# Altium schematic sheet 5R_Supply.SchDoc: 5R Supply
size OrCAD A; DocumentNumber: LM-008; Revision: B; SheetNumber: 3; SheetTotal: 7
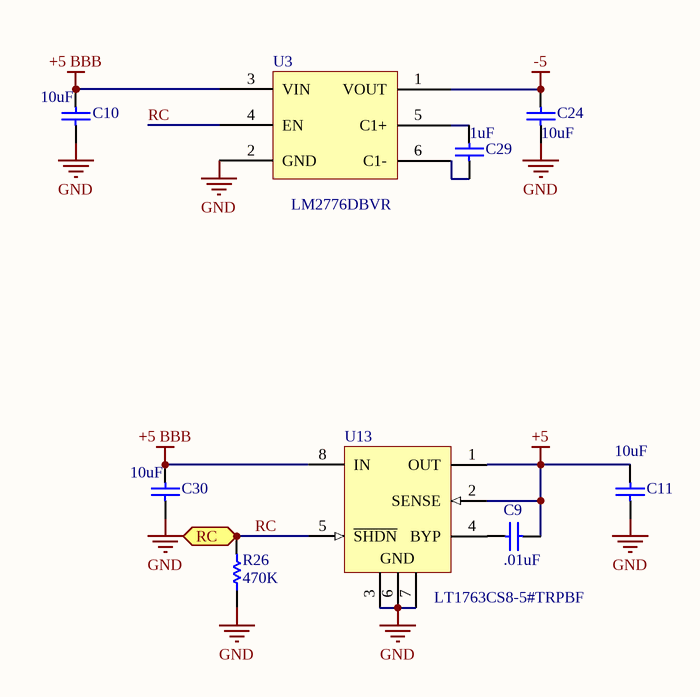
[diagram p0: 5R_Supply.SchDoc]

## Parts
C9  .01uF  [CAPC0805(2012)145_N]
C10  10uF  [CAPC0805(2012)145_N]
C11  10uF  [CAPC0805(2012)145_N]
C24  10uF  [CAPC0805(2012)145_N]
C29  1uF  [CAPC0805(2012)145_N]
C30  10uF  [CAPC0805(2012)145_N]
R26  470K  [RESC0805(2012)_M]
U3  LM2776DBVR  [LM2776DBVR]
U13  LT1763CS8-5#TRPBF  [LT-S8-8_M]

## Ports
RC

## Nets
+5: C9.2 C11.1 U13.1(OUT) U13.2(SENSE)
+5 BBB: C10.1 C30.1 U3.3(VIN) U13.8(IN)
-5: C24.1 U3.1(VOUT)
GND: C10.2 C11.2 C24.2 C30.2 R26.1 U3.2(GND) U13.3(GND) U13.6(GND) U13.7(GND)
RC: R26.2 U3.4(EN) U13.5(~{SHDN}) ; port RC
NetC9_1: C9.1 U13.4(BYP)
NetC29_1: C29.1 U3.5(C1+)
NetC29_2: C29.2 U3.6(C1-)

## Notes on the sheet
- Title
- Size:
- Date:
- Orcad A
- Number:
- Time:
- Revision:
- Sheet
- of
- ZLS Corporation
- 7801 North Lamar Blvd.
- Suite E-184
- Austin, Texas 78752  USA
- (512) 453-0288
- File:

## Library data of the parts
C9 = CMP-1036-04795-1: Manufacturer: Yageo; Manufacturer Part Number: AC0805KRX7R7BB103; Description: CAP CER 10000PF 16V X7R 0805; Tolerance: ±10%; Voltage - Rated: 16V; Temperature Coefficient: X7R; Supplier 1: Digi-Key; Supplier Part Number 1: 311-3161-6-ND; RoHS: RoHS Compliant; Category: Capacitors; Stock 1: 311; Pricing 1: 1=0.22, 10=0.158, 100=0.0745, 500=0.05224, 1000=0.04324 (USD); Packaging: Digi-Reel®; Part Status: Active; Operating Temperature: -55°C ~ 125°C; Features: -; Ratings: AEC-Q200; Applications: Automotive; Failure Rate: -; Mounting Type: Surface Mount, MLCC; Package / Case: 0805 (2012 Metric); Size / Dimension: 0.079" L x 0.049" W (2.00mm x 1.25mm); Height - Seated (Max): -; Thickness (Max): 0.037" (0.95mm); Lead Spacing: -; Lead Style: -; ComponentLink1URL: http://www.yageo.com/NewPortal/_en/search/productDocs.jsp?YageoPartNumber=AC0805KRX7R7BB103; ComponentLink1Description: http://www.yageo.com/NewPortal/_en/search/productDocs.jsp?YageoPartNumber=AC0805KRX7R7BB103
C10 C11 C24 C30 = CMP-1036-04795-1: CAP CER 10UF 25V X7R 0805; Manufacturer: Yageo; Manufacturer Part Number: CC0805KKX7R6BB106; Description: CAP CER 10UF 10V X7R 0805; Tolerance: ±10%; Voltage - Rated: 10V; Notification: Current market demand for these product types have resulted in fluctuating and extending lead times. Lead times may differ.; Supplier 1: Digi-Key; Supplier Part Number 1: 311-1879-6-ND; RoHS: RoHS Compliant; Category: Capacitors; Stock 1: 0; Pricing 1: 1=0.45 (USD); Packaging: Digi-Reel®; Part Status: Discontinued at Digi-Key; Temperature Coefficient: X7R; Operating Temperature: -55°C ~ 125°C; Features: -; Ratings: -; Applications: General Purpose; Failure Rate: -; Mounting Type: Surface Mount, MLCC; Package / Case: 0805 (2012 Metric); Size / Dimension: 0.079" L x 0.049" W (2.00mm x 1.25mm); Height - Seated (Max): -; Thickness (Max): 0.057" (1.45mm); Lead Spacing: -; Lead Style: -; ComponentLink1URL: http://www.yageo.com/documents/recent/UPY-GPHC_X7R_6.3V-to-50V_18.pdf; ComponentLink1Description: http://www.yageo.com/documents/recent/UPY-GPHC_X7R_6.3V-to-50V_18.pdf
C29 = CMP-1036-04795-1: CAP CER 1UF 25V X7R 0805; Manufacturer: Yageo; Manufacturer Part Number: CC0805KKX7R6BB105; Description: CAP CER 1UF 10V X7R 0805; Tolerance: ±10%; Voltage - Rated: 10V; Notification: Current market demand for these product types have resulted in fluctuating and extending lead times. Lead times may differ.; Supplier 1: Digi-Key; Supplier Part Number 1: 311-1458-6-ND; RoHS: RoHS Compliant; Category: Capacitors; Stock 1: 30000; Pricing 1: 1=0.25, 10=0.168, 100=0.0852, 500=0.0583, 1000=0.05158 (USD); Packaging: Digi-Reel®; Part Status: Active; Temperature Coefficient: X7R; Operating Temperature: -55°C ~ 125°C; Features: -; Ratings: -; Applications: General Purpose; Failure Rate: -; Mounting Type: Surface Mount, MLCC; Package / Case: 0805 (2012 Metric); Size / Dimension: 0.079" L x 0.049" W (2.00mm x 1.25mm); Height - Seated (Max): -; Thickness (Max): 0.057" (1.45mm); Lead Spacing: -; Lead Style: -; ComponentLink1URL: http://www.yageo.com/documents/recent/UPY-GPHC_X7R_6.3V-to-50V_18.pdf; ComponentLink1Description: http://www.yageo.com/documents/recent/UPY-GPHC_X7R_6.3V-to-50V_18.pdf
R26 = CMP-1013-00017-1: RES SMD 59K OHM 1% 1/8W 0805
U3 = LM2776DBVR: IC REG SWTCHD CAP INV 6SOT23; Manufacturer: Texas Instruments; Function: Ratiometric; Output Configuration: Negative; Topology: Charge Pump; Output Type: Fixed; Number of Outputs: 1; Voltage - Input (Min): 2.7V; Voltage - Input (Max): 5.5V; Voltage - Output (Min/Fixed): -Vin; Current - Output: 200mA; Frequency - Switching: 2MHz; Synchronous Rectifier: No; Supplier 1: Digi-Key; Supplier Part Number 1: 296-43957-6-ND; Manufacturer Part Number: LM2776DBVR; RoHS: RoHS Compliant; Category: Integrated Circuits (ICs); Stock 1: 13045; Pricing 1: 1=1.05, 10=0.936, 100=0.7297, 500=0.60276, 1000=0.47586 (USD); Packaging: Digi-Reel®; Part Status: Active; Voltage - Output (Max): -; Operating Temperature: -40°C ~ 85°C (TA); Mounting Type: Surface Mount; Package / Case: SOT-23-6; Supplier Device Package: SOT-23-6; ComponentLink1URL: http://www.ti.com/lit/ds/symlink/lm2776.pdf; ComponentLink1Description: http://www.ti.com/lit/ds/symlink/lm2776.pdf
U13 = CMP-0476-01685-1: 500 mA, Low Noise, LDO Micropower Regulator, 1.8 to 20 V Vin, 5 V Vout, 8-pin SOIC (S8-8), -40 to 125 degC, Pb-Free; Manufacturer: Linear Technology/Analog Devices; Description: IC REG LINEAR 5V 500MA 8SOIC; Output Configuration: Positive; Output Type: Fixed; Voltage - Input (Max): 20V; Voltage - Output (Min/Fixed): 5V; Voltage Dropout (Max): 0.45V @ 500mA; Current - Output: 500mA; PSRR: 65dB (120Hz); Control Features: Enable; Protection Features: Over Current, Over Temperature, Reverse Polarity; Supplier 1: Digi-Key; Supplier Part Number 1: LT1763CS8-5#TRPBFDKR-ND; Manufacturer Part Number: LT1763CS8-5#TRPBF; RoHS: RoHS Compliant; Category: Integrated Circuits (ICs); Stock 1: 2002; Pricing 1: 1=4.88, 25=4.3568, 100=2.6316, 250=2.41232 (USD); Packaging: Digi-Reel®; Part Status: Active; Voltage - Output (Max): -; Operating Temperature: -40°C ~ 125°C; Mounting Type: Surface Mount; Package / Case: 8-SOIC (0.154", 3.90mm Width); Supplier Device Package: 8-SOIC; Base Part Number: LT1763; ComponentLink1URL: http://www.linear.com/docs/3903; ComponentLink1Description: http://www.linear.com/docs/3903